# Altium schematic sheet Sheet1.SchDoc
size A3
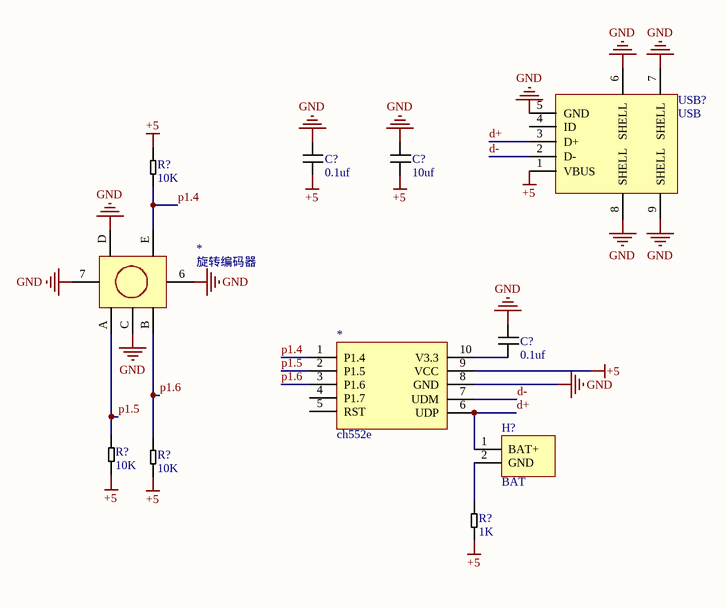
[diagram p0: Sheet1.SchDoc]

## Parts
(Parts that share a designator on the sheet are numbered #1, #2 ... from top to bottom, then left to right.)
*#1  旋转编码器  [SW-TH_EC11XXXXXXXX]
*#2  ch552e  [ch552e]
C?#1  0.1uf  [0805CAP]
C?#2  10uf  [0805CAP]
C?#3  0.1uf  [0805CAP]
H?  BAT  [BAT]
R?#1  10K  [0805R]
R?#2  10K  [0805R]
R?#3  10K  [0805R]
R?#4  1K  [0805R]
USB?  USB  [micro usb]

## Nets
+5: *#2.9(VCC) C?#1.1(SHELL) C?#2.1(SHELL) R?#1.1 R?#2.1 R?#3.1 R?#4.1 USB?.1(VBUS)
GND: *#1.6 *#1.7 *#1.C *#1.D *#2.8(GND) C?#1.2(SHELL) C?#2.2(SHELL) C?#3.2(SHELL) USB?.5(GND) USB?.6(SHELL) USB?.7(SHELL) USB?.8(SHELL) USB?.9(SHELL)
d+: *#2.6(UDP) H?.1(BAT+) USB?.3(D+)
d-: *#2.7(UDM) USB?.2(D-)
p1.4: *#1.E *#2.1(P1.4) R?#1.2
p1.5: *#1.A *#2.2(P1.5) R?#2.2
p1.6: *#1.B *#2.3(P1.6) R?#3.2
Net*#2_10: *#2.10(V3.3) C?#3.1(SHELL)
NetH?_2: H?.2(GND) R?#4.2

Not connected (* = marked no-connect by the designer): *#2 4(P1.7) 5(RST); USB? 4(ID)

## Library data of the parts
C?#1-C?#3 = CAP
R?#1-R?#4 = RES
USB? = micro_usb